# Altium project TDR.PrjPcb
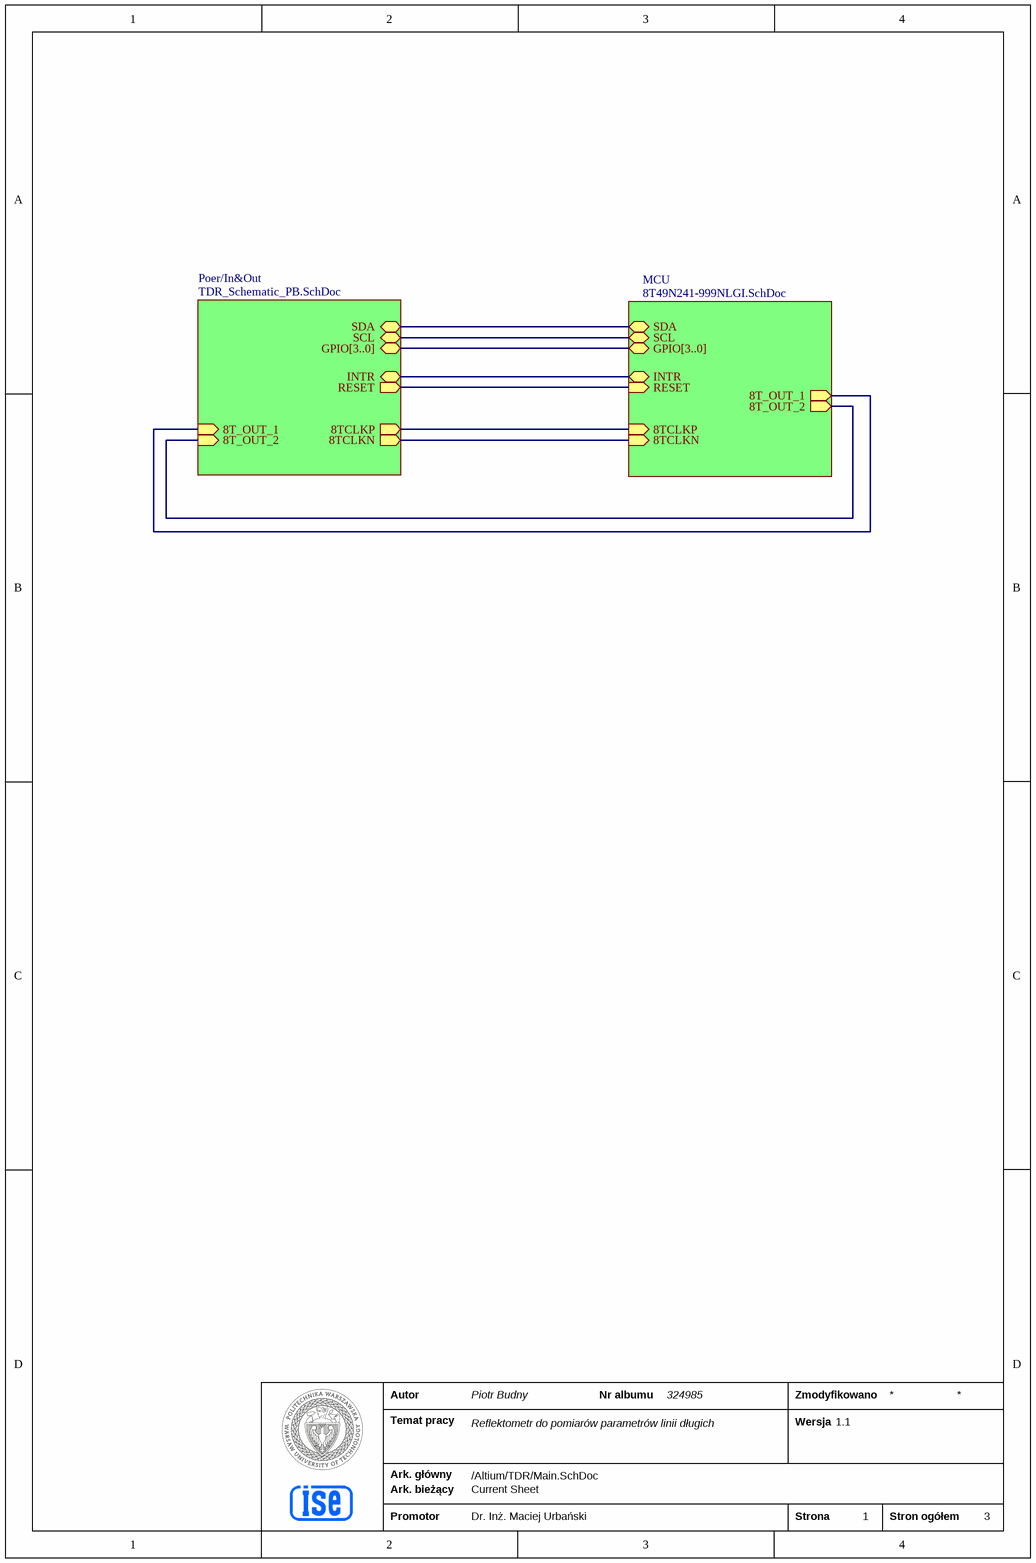
[diagram p0: Main.SchDoc]
3 sheets, 87 parts. Net scope: hierarchical (ports join the sheet entries above them; power ports are global).
Board file: TDR3.PcbDoc
Sheets:
  Main.SchDoc
    Poer/In&Out = TDR_Schematic_PB.SchDoc
    MCU = 8T49N241-999NLGI.SchDoc

## Sheet Main.SchDoc
size A4 portrait; SheetNumber: 1; SheetTotal: 3

### Sub-sheets
MCU = 8T49N241-999NLGI.SchDoc: SDA (bidir), SCL (bidir), GPIO[3..0] (bidir), RESET (in), 8TCLKP (in), 8TCLKN (in), 8T_OUT_1 (out), 8T_OUT_2 (out), INTR (bidir)
Poer/In&Out = TDR_Schematic_PB.SchDoc: SDA (bidir), SCL (bidir), GPIO[3..0] (bidir), INTR (bidir), RESET (out), 8T_OUT_1 (in), 8T_OUT_2 (in), 8TCLKP (out), 8TCLKN (out)

### Nets
8T_CLK_N: sheet Poer/In&Out/8TCLKN, sheet MCU/8TCLKN
8T_CLK_P: sheet Poer/In&Out/8TCLKP, sheet MCU/8TCLKP
8T_OUT_1: sheet Poer/In&Out/8T_OUT_2, sheet MCU/8T_OUT_2
8T_OUT_2: sheet Poer/In&Out/8T_OUT_1, sheet MCU/8T_OUT_1
INTR: sheet Poer/In&Out/INTR, sheet MCU/INTR
RESET: sheet Poer/In&Out/RESET, sheet MCU/RESET
SCL: sheet Poer/In&Out/SCL, sheet MCU/SCL
SDA: sheet Poer/In&Out/SDA, sheet MCU/SDA

### Buses and harness runs
bus sheet MCU/GPIO[3..0] = sheet Poer/In&Out/GPIO[3..0]

### Notes on the sheet
- Autor
- Temat pracy
- Piotr Budny
- Reflektometr do pomiarów parametrów linii długich
- Nr albumu
- 324985
- Zmodyfikowano
- Wersja
- 1.1
- Ark. główny
- Ark. bieżący
- /Altium/TDR/Main.SchDoc
- Current Sheet
- Promotor
- Dr. Inż. Maciej Urbański
- Strona
- Stron ogółem

## Sheet TDR_Schematic_PB.SchDoc: Bardzo zaawansowany, madrze brzmiacy temat pracy dyplomowej. Jest tez bardzo dlugi.
size A4 portrait; Author: Student X.; Revision: 1.1; SheetNumber: 2; SheetTotal: 3; Comments: param:Comments; Wersja: 1.0; CustomerInfo: CustInfo; CustomerAddress: CustAddr; CopyrightBy: Maciejo; CopyrightDate: 2016; TopSheet: Nazwa lub sciezka do pliku z glownym schematem projektu; CurrentSheet: Current sheet; NrIndeksu: 123456; Promotor: Prof. dr. hab. inż. arch. lek. artysta i tynkarz; ProjectName: Project Name
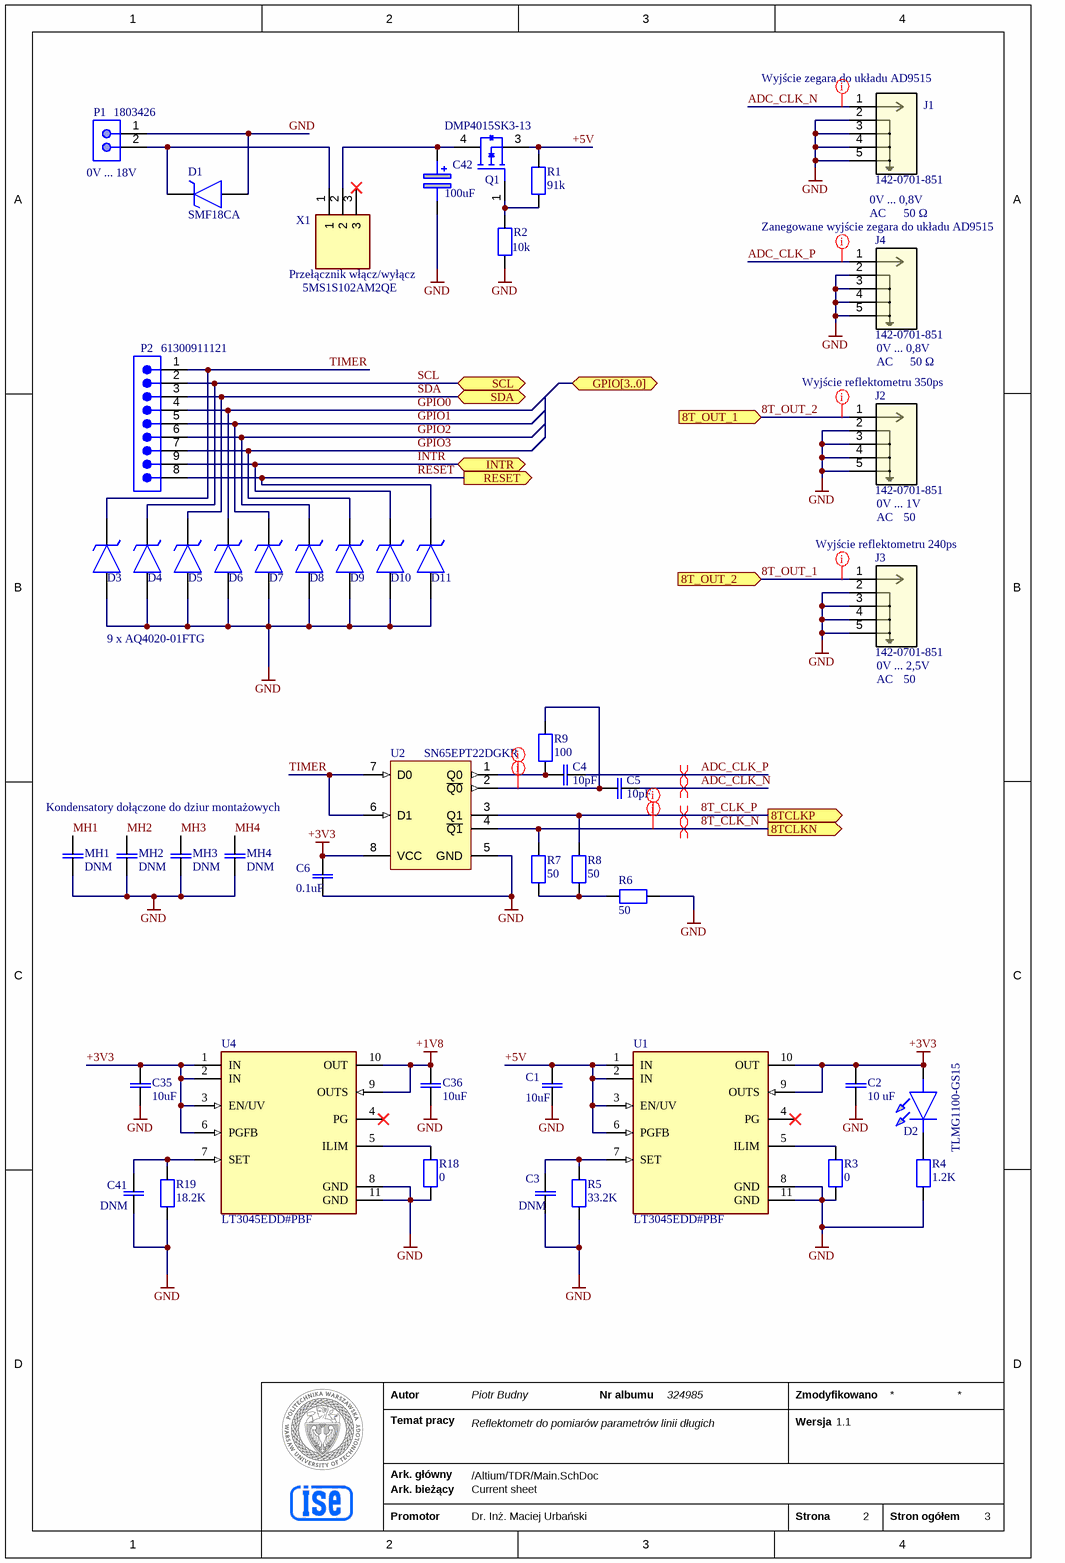
[diagram p1: TDR_Schematic_PB.SchDoc]

### Parts
C1  10uF  [CAP_C0805X-HAC-DR_KEM]
C2  10 uF  [CAP_C0805X-HAC-DR_KEM]
C3  DNM  [CAP_C0805X-HAC-DR_KEM]
C4  10pF  [CAPC0402]
C5  10pF  [CAPC0402]
C6  0.1uF  [CAPC0603]
C35  10uF  [CAP_C0805X-HAC-DR_KEM]
C36  10uF  [CAP_C0805X-HAC-DR_KEM]
C41  DNM  [CAP_C0805X-HAC-DR_KEM]
C42  100uF  [CAPPRD200W55D500H1250 - duplicate]
D1  SMF18CA  [SODFL3618X110N]
D2  TLMG1100-GS15  [TLMG1100GS15]
D3  AQ4020-01FTG  [SOD2613X114N]  (value not drawn)
D4  AQ4020-01FTG  [SOD2613X114N]  (value not drawn)
D5  AQ4020-01FTG  [SOD2613X114N]  (value not drawn)
D6  AQ4020-01FTG  [SOD2613X114N]  (value not drawn)
D7  AQ4020-01FTG  [SOD2613X114N]  (value not drawn)
D8  AQ4020-01FTG  [SOD2613X114N]  (value not drawn)
D9  AQ4020-01FTG  [SOD2613X114N]  (value not drawn)
D10  AQ4020-01FTG  [SOD2613X114N]  (value not drawn)
D11  AQ4020-01FTG  [SOD2613X114N]  (value not drawn)
J1  142-0701-851  [CONN_142-0701-851_CIN]
J2  142-0701-851  [CONN_142-0701-851_CIN]
J3  142-0701-851  [CONN_142-0701-851_CIN]
J4  142-0701-851  [CONN_142-0701-851_CIN]
MH1  DNM  [CAPC0603]
MH2  DNM  [CAPC0603]
MH3  DNM  [CAPC0603]
MH4  DNM  [CAPC0603]
P1  1803426  [PHOE-1803426_V]
P2  61300911121  [61300911121]
Q1  DMP4015SK3-13  [DMP4015SK3-13]
R1  91k  [RES0805]
R2  10k  [RES0805]
R3  0  [RES0805]
R4  1.2K  [RESC0603]
R5  33.2K  [RES0805]
R6  50  [RESC0603]
R7  50  [RESC0603]
R8  50  [RESC0603]
R9  100  [RESC0603]
R18  0  [RES0805]
R19  18.2K  [RES0805]
U1  LT3045EDD#PBF  [FP-LT3045EDD#PBF-MFG]
U2  SN65EPT22DGKR  [DGK0008A_M]
U4  LT3045EDD#PBF  [FP-LT3045EDD#PBF-MFG]
X1  5MS1S102AM2QE  [5MS1S102AM2QE]  (value not drawn)

### Ports
8T_OUT_1 (in, see Main[1B], 8T49N241-999NLGI[4B]), 8T_OUT_2 (in, see Main[1B], 8T49N241-999NLGI[4C]), 8TCLKN (out, see Main[2B], 8T49N241-999NLGI[2B]), 8TCLKP (out, see Main[2B], 8T49N241-999NLGI[2B]), GPIO[3..0] (bidir, see Main[2A], 8T49N241-999NLGI[1C]), INTR (bidir, see Main[2A], 8T49N241-999NLGI[1C]), RESET (out, see Main[2A], 8T49N241-999NLGI[1C]), SCL (bidir, see Main[2A], 8T49N241-999NLGI[1B]), SDA (bidir, see Main[2A], 8T49N241-999NLGI[1B])

### Nets
+1V8: C36.2 U4.9(OUTS) U4.10(OUT)  [project net VCO3]
+3V3: C2.2 C6.2 C35.2 D2.2(A) U1.9(OUTS) U1.10(OUT) U2.8(VCC) U4.1(IN) U4.2(IN) U4.3(EN/UV) U4.6(PGFB)
GND: C1.1 C2.1 C3.1 C6.1 C35.1 C36.1 C41.1 C42.2(-) D1.2(A) D3.2(A) D4.2(A) D5.2(A) D6.2(A) D7.2(A) D8.2(A) D9.2(A) D10.2(A) D11.2(A) J1.2 J1.3 J1.4 J1.5 J2.2 J2.3 J2.4 J2.5 J3.2 J3.3 J3.4 J3.5 J4.2 J4.3 J4.4 J4.5 MH1.1 MH2.1 MH3.1 MH4.1 P1.1 R2.1 R3.1 R4.1 R5.1 R6.1 R18.1 R19.1 U1.8(GND) U1.11(GND) U2.5(GND) U4.8(GND) U4.11(GND)
8T_CLK_N: R7.2 U2.4(~{Q1}) ; port 8TCLKN
8T_CLK_P: R8.2 U2.3(Q1) ; port 8TCLKP
8T_OUT_1: J3.1 ; port 8T_OUT_2
8T_OUT_2: J2.1 ; port 8T_OUT_1
+5V: C1.2 Q1.3 R1.2 U1.1(IN) U1.2(IN) U1.3(EN/UV) U1.6(PGFB)
ADC_CLK_N: C5.2 J1.1
ADC_CLK_P: C4.2 J4.1
GPIO0: D6.1(K) P2.4
GPIO1: D7.1(K) P2.5
GPIO2: D8.1(K) P2.6
GPIO3: D9.1(K) P2.7
INTR: D10.1(K) P2.9 ; port INTR
MH1: MH1.2
MH2: MH2.2
MH3: MH3.2
MH4: MH4.2
RESET: D11.1(K) P2.8 ; port RESET
SCL: D4.1(K) P2.2 ; port SCL
SDA: D5.1(K) P2.3 ; port SDA
TIMER: D3.1(K) P2.1 U2.6(D1) U2.7(D0)
NetC3_2: C3.2 R5.2 U1.7(SET)
NetC4_1: C4.1 R9.1 U2.1(Q0)
NetC5_1: C5.1 R9.2 U2.2(~{Q0})
NetC41_2: C41.2 R19.2 U4.7(SET)
NetC42_1: C42.1(+) Q1.4 X1.2
NetD1_1: D1.1(K) P1.2 X1.1
NetD2_1: D2.1(K) R4.2
NetQ1_1: Q1.1 R1.1 R2.2
NetR3_2: R3.2 U1.5(ILIM)
NetR6_2: R6.2 R7.1 R8.1
NetR18_2: R18.2 U4.5(ILIM)

Not connected (* = marked no-connect by the designer): U1 4(PG)*; U4 4(PG)*; X1 3*

### Layout directives
differential pair: 8T_CLK_N, 8T_CLK_P, ADC_CLK_N, ADC_CLK_P
net class Signal: 8T_OUT_1, 8T_OUT_2
net class Diff_Signal: 8T_CLK_N, 8T_CLK_P, ADC_CLK_N, ADC_CLK_P, NetC4_1, NetC5_1

### Notes on the sheet
- (near J1) Wyjście zegara do układu AD9515
- (near P1) 0V ... 18V
- (near J4) Zanegowane wyjście zegara do układu AD9515
- 0V ... 0,8V
- AC
- 50 Ω
- Przełącznik włącz/wyłącz
- 5MS1S102AM2QE
- (near J4) 0V ... 0,8V
- (near J2) Wyjście reflektometru 350ps
- (near J2) 0V ... 1V
- (near J3) Wyjście reflektometru 240ps
- 50
- 9 x AQ4020-01FTG
- (near J3) 0V ... 2,5V
- (near J3) AC
- (near J3) 50
- Kondensatory dołączone do dziur montażowych
- Autor
- Temat pracy
- Piotr Budny
- Reflektometr do pomiarów parametrów linii długich
- Nr albumu
- 324985
- Zmodyfikowano
- Wersja
- Ark. główny
- Ark. bieżący
- /Altium/TDR/Main.SchDoc
- Promotor
- Dr. Inż. Maciej Urbański
- Strona
- Stron ogółem

### Library data of the parts
C1-C3 C35 C36 C41 = C0805X399C8HAC7800: No Description Available; Manufacturer_Name: Kemet; Copyright: Copyright (C) 2025 Ultra Librarian. All rights reserved.; Manufacturer_Part_Number: C0805X399C8HAC7800
C4 C5 = C0603: No Description Available; Manufacturer_Name: Kemet; Manufacturer_Part_Number: C0805X399C8HAC7800; Copyright: Copyright (C) 2025 Ultra Librarian. All rights reserved.
C6 MH1-MH4 = C0603: CAP SMD 0805; Manufacturer_Name: Kemet; Manufacturer_Part_Number: C0805X399C8HAC7800; Copyright: Copyright (C) 2025 Ultra Librarian. All rights reserved.
C42 = 100uF electrolitic
D1 = SMF5.0A-T13: TVS Diode (Uni-directional); Manufacturer_Name: LITTELFUSE; Datasheet Link: https://www.littelfuse.com/~/media/electronics/datasheets/tvs_diodes/littelfuse_tvs_diode_smf_datasheet.pdf.pdf; Height: 1.1mm; Manufacturer_Part_Number: SMF5.0A-T13; Mouser Part Number: 576-SMF5.0A-T13; Mouser Price/Stock: https://www.mouser.co.uk/ProductDetail/Littelfuse/SMF5.0A-T13?qs=aGgfWYEhH7lEohru0mAWAg%3D%3D; Arrow Part Number: SMF5.0A-T13; Arrow Price/Stock: https://www.arrow.com/en/products/smf5.0a-t13/littelfuse?utm_currency=USD&region=nac
D2 = TLMG1100-GS15: Standard LEDs - SMD CHIPLED(SMD 0603-LED) GREEN U.BRIGHT-E4; Manufacturer_Name: Vishay; Geometry.Height: 0.65mm; Mouser Part Number: 78-TLMG1100-GS15; Mouser Price/Stock: https://www.mouser.co.uk/ProductDetail/Vishay-Semiconductors/TLMG1100-GS15?qs=vvQtp7zwQdObPNLeC1kn7g%3D%3D; Manufacturer_Part_Number: TLMG1100-GS15; Datasheet Link: https://www.vishay.com/docs/83173/tlmx1100.pdf
D3-D11 = AQ4020-01FTG: TVS Diode (Uni-directional); Manufacturer_Name: LITTELFUSE; Datasheet Link: https://componentsearchengine.com/Datasheets/2/AQ4020-01FTG.pdf; Height: 1.14mm; Manufacturer_Part_Number: AQ4020-01FTG; Mouser Part Number: 576-AQ4020-01FTG; Mouser Price/Stock: https://www.mouser.co.uk/ProductDetail/Littelfuse/AQ4020-01FTG?qs=YCa%2FAAYMW015W3B84qpvIw%3D%3D; Arrow Part Number: AQ4020-01FTG; Arrow Price/Stock: https://www.arrow.com/en/products/aq4020-01ftg/littelfuse?utm_currency=USD&region=nac
J1-J4 = 142-0701-851: Description; Manufacturer_Name: Cinch Connectivity Solutions; Copyright: Copyright (C) 2025 Ultra Librarian. All rights reserved.; Manufacturer_Part_Number: 142-0701-851; RefDes: RefDes; Type: Type
P1 = CMP-2000-05826-1: Male Header, Pitch 3.81 mm, 1 x 2 Position, Height 9.2 mm, Tail Length 3.4 mm; Manufacturer: Phoenix Contact; Manufacturer URL: http://www.phoenixcontact.com/; Datasheet Version: 02/2015; Mounting Technology: ThroughHole; Package Description: Male Header, Pitch 3.81 mm, 1 x 2 Position, Height 9.2 mm; Datasheet URL: https://www.phoenixcontact.com/online/portal/cn/pxc/product_detail_page/!ut/p/b1/3VfHjrNIGHyWeQDG5HAkm5zjxQIM2AQDNvnp1zNa7WFX889l5YPpA6L1qUtVdFX3d4gPEYCiFAaBJHgID_Etma9lMl67W9J8fcf4iRJ1HIRRHAIZDANpTKVtR3IFAyUOwSEE0ZNTbb2iOquuOqg8OKsEReRD0XpT8cAJtHK1h62gd5Lwwj7fSR7gfNZiWNE2tu2Xg71pvaHw3VHbDIccysUbixteZxggMWJnxWgP9KIolKko13HrKNI0OD69xjcsLwZb9oJmcNi4flh1xw9LW6-eWTQ9nREGMg82nQ7i5d6Jdk07dw7fZbrokLagaoyYggEvB4C7H5W4HERjSAam7I1pSvC1iqzSu8itk8CidtE6n3bP2nD0Pp6iRD-LQiLob5pFzwLixwIWO7iH0PcgleukhedgldkYbrFLA5WSM7ufG5_qGPkUc9vEzZQaS901mlWkPYn5tWxhabkCUfW4SsSIbpPuMIJHpQReslhERyEnqVrZBIU1V5Nilrs5X123FVtC3BVOSLHMP1b6PfXsNSgk1T-F50SEmtzqQUXqhsW5rwQ1o0BXB2gELrcQ4gCUoNAFTBX6N2LEmxJz0Hclhr8rsXf1mPOuHoPf1WPwu3oMflePSW-7Fd81PGj4i1jqc2r6kGnO3K4b7QxsE14hAduG8C7FaT2GvZ7I-s0j05SGAI1kaO9y99Mt55acg9cLDNYaWwQcdDTPAtjrfMY1OBkOcVEr9HZ8tGspIQLbIVDtpjctgzHFMG4BAZsGvQthBBH4WA-nFo17BJ08nhvnnSIvtClxxDZLZLDt43EXgXAD-FUl6xp1LReX8w3Sb-3dEFiLergsTPmiPWlKHKTnUE9MvjMWis8MoKAxhXcLRQoyR1OjaJFnuS2q9AQSlWi71_PQS1I7hwNcTAR9vGjIY_k4yIf4mrafS9Z-gp_9mn329-4; Package Reference: 1803426
P2 = CMP-1502-01080-4: THT Vertical Pin Header WR-PHD, Pitch 2.54 mm, Single Row, 9 pins; Current Rating: 3A; Connector Type: Male Pin; Operating Supply Voltage: 250V; Contact Resistance: 20mΩ; Pitch: 2.54mm; Number of Contacts: 9; Gender: Male; Lead Pitch: 2.54mm; Number of Rows: 1; Mount: Through Hole; Contact Plating: Gold; Color: Black; Number of Pins: 9; Orientation: Vertical; Contact Material: Copper; Packaging: Bulk; Contact Mating Length: 5.9944mm; RoHS: Compliant; Number of Positions: 9; Termination: Solder
R1-R3 R5 R18 R19 = R0805: RES SMD 0805; MP: RT0805FRE075K36L; Package: None; Price: None; Value: *; Availability: Unavailable
R4 R6-R9 = R0603: RES SMD 0603; MP: RT0805FRE075K36L; Package: None; Price: None; Value: *; Availability: Unavailable
U1 U4 = CMP-09138-000240-1: IC REG LINEAR 0V 500MA 10DFN; Min Current Limit: 570mA; Number of Regulators: 1; Dropout Voltage: 260mV; Output Voltage: 15V; RoHS Compliant: Yes; Series: -; Output Current: 500mA; Case/Package: DFN; Max Operating Temperature: 125°C; Min Operating Temperature: -40°C
U2 = CMP-0327-00215-3: 4000 Mbps 3.3 V Dual LVTTL / LVCMOS to Differential LVPECL Buffer, 2 Tx and 2 Rx, -40 to +85 degC, 8-pin VSSOP (DGK), Green (RoHS & no Sb/Br); Manufacturer: Texas Instruments; ICC(Max)(mA): 50; Input Signal: LVTTL, CMOS; No. of Rx: 2; SubFamily: PECL PHY; Signaling Rate(Mbps): 4000; xECL: TRUE; DatasheetVersion: SLLS926A; Output Signal: LVPECL; ComponentLink3Description: URL Link1; PackageVersion: revE, May-2006; ComponentLink1Description: Manufacturer URL; ComponentLink2Description: Datasheet; No. of Tx: 2; ComponentLink1URL: http://www.ti.com/; PackageReference: DGK0008A; Eco-Plan: Green (RoHS & no Sb/Br); Mounting Technology: Surface Mount; PackageDescription: 8-Pin Thin Small Outline Package 3 x 3 mm Body ,0.65 mm Pitch; ComponentLink2URL: http://www.ti.com/general/docs/lit/getliterature.tsp?genericPartNumber=SN65EPT22&fileType=pdf; ComponentLink3URL: SamplesURL:http://www.ti.com/product/sn65ept22#samples; PartNumber: SN65EPT22DGKR
X1 = 5MS1S102AM2QE: Switch: Slide; Positions: 2; SPDT; 2A/250VAC; 5A/28VDC; ON-ON; Manufacturer_Name: LIGHT COUNTRY; Geometry.Height: 12.93mm; TME Electronic Components Part Number: *; TME Electronic Components Price/Stock: *; Manufacturer_Part_Number: 5MS1S102AM2QE; Datasheet Link: https://www.tme.eu/Document/6c0299ce3235dd46f456febe8a77357f/slide_switch_5M.PDF

## Sheet 8T49N241-999NLGI.SchDoc: Bardzo zaawansowany, madrze brzmiacy temat pracy dyplomowej. Jest tez bardzo dlugi.
size A4 portrait; Author: Student X.; Revision: 1.1; SheetNumber: 3; SheetTotal: 3; Comments: param:Comments; Wersja: 1.1; CustomerInfo: CustInfo; CustomerAddress: CustAddr; CopyrightBy: Maciejo; CopyrightDate: 2016; TopSheet: Nazwa lub sciezka do pliku z glownym schematem projektu; CurrentSheet: Current sheet; NrIndeksu: 123456; Promotor: Prof. dr. hab. inż. arch. lek. artysta i tynkarz; ProjectName: Project Name
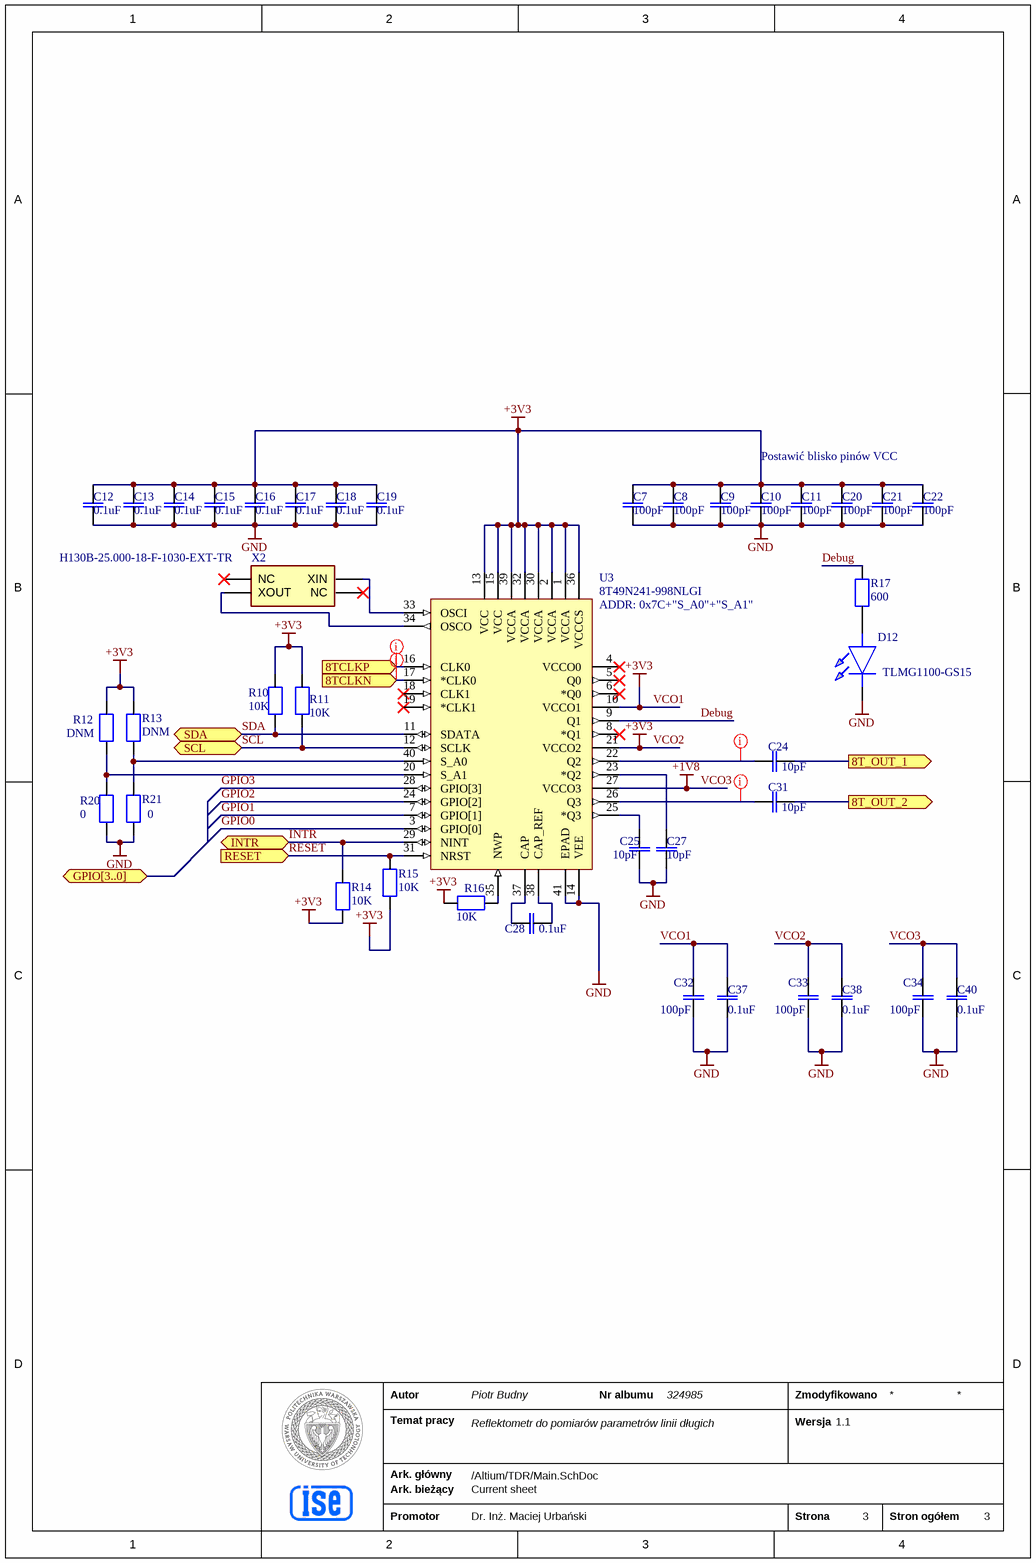
[diagram p2: 8T49N241-999NLGI.SchDoc]

### Parts
C7  100pF  [CAPC0603]
C8  100pF  [CAPC0603]
C9  100pF  [CAPC0603]
C10  100pF  [CAPC0603]
C11  100pF  [CAPC0603]
C12  0.1uF  [CAPC0603]
C13  0.1uF  [CAPC0603]
C14  0.1uF  [CAPC0603]
C15  0.1uF  [CAPC0603]
C16  0.1uF  [CAPC0603]
C17  0.1uF  [CAPC0603]
C18  0.1uF  [CAPC0603]
C19  0.1uF  [CAPC0603]
C20  100pF  [CAPC0603]
C21  100pF  [CAPC0603]
C22  100pF  [CAPC0603]
C24  10pF  [CAPC0402]
C25  10pF  [CAPC0402]
C27  10pF  [CAPC0402]
C28  0.1uF  [CAPC0603]
C31  10pF  [CAPC0402]
C32  100pF  [CAPC0603]
C33  100pF  [CAPC0603]
C34  100pF  [CAPC0603]
C37  0.1uF  [CAPC0603]
C38  0.1uF  [CAPC0603]
C40  0.1uF  [CAPC0603]
D12  TLMG1100-GS15  [TLMG1100GS15]
R10  10K  [RES0805]
R11  10K  [RES0805]
R12  DNM  [RES0805]
R13  DNM  [RES0805]
R14  10K  [RES0805]
R15  10K  [RES0805]
R16  10K  [RES0805]
R17  600  [RES0805]
R20  0  [RES0805]
R21  0  [RES0805]
U3  8T49N241-998NLGI  [NLG40P2_MFG]
X2  H130B-25.000-18-F-1030-EXT-TR  [H130B2500018F1030EXTTR]

### Ports
8T_OUT_1 (out, see Main[4B], TDR_Schematic_PB[3B]), 8T_OUT_2 (out, see Main[4B], TDR_Schematic_PB[3B]), 8TCLKN (in, see Main[3B], TDR_Schematic_PB[3C]), 8TCLKP (in, see Main[3B], TDR_Schematic_PB[3C]), GPIO[3..0] (bidir, see Main[3A], TDR_Schematic_PB[3A]), INTR (bidir, see Main[3A], TDR_Schematic_PB[2B]), RESET (in, see Main[3A], TDR_Schematic_PB[2B]), SCL (bidir, see Main[3A], TDR_Schematic_PB[2A]), SDA (bidir, see Main[3A], TDR_Schematic_PB[2B])

### Nets
+3V3: C7.1 C8.1 C9.1 C10.1 C11.1 C12.2 C13.2 C14.2 C15.2 C16.2 C17.2 C18.2 C19.2 C20.1 C21.1 C22.1 C32.1 C33.1 C37.2 C38.2 R10.2 R11.2 R12.2 R13.2 R14.1 R15.1 R16.2 U3.1(VCCA) U3.2(VCCA) U3.10(VCCO1) U3.13(VCC) U3.15(VCC) U3.21(VCCO2) U3.30(VCCA) U3.32(VCCA) U3.36(VCCCS) U3.39(VCCA)  [also labelled VCO1, VCO2]
GND: C7.2 C8.2 C9.2 C10.2 C11.2 C12.1 C13.1 C14.1 C15.1 C16.1 C17.1 C18.1 C19.1 C20.2 C21.2 C22.2 C25.1 C27.1 C32.2 C33.2 C34.2 C37.1 C38.1 C40.1 D12.1(K) R20.1 R21.1 U3.14(VEE) U3.41(EPAD)
VCO3: C34.1 C40.2 U3.27(VCCO3)  [also labelled +1V8]
8T_CLK_N: U3.17(*CLK0) ; port 8TCLKN
8T_CLK_P: U3.16(CLK0) ; port 8TCLKP
8T_OUT_1: C31.2 ; port 8T_OUT_2
8T_OUT_2: C24.2 ; port 8T_OUT_1
Debug: R17.1 U3.9(Q1)
GPIO0: U3.3(GPIO[0])
GPIO1: U3.7(GPIO[1])
GPIO2: U3.24(GPIO[2])
GPIO3: U3.28(GPIO[3])
INTR: R14.2 U3.29(NINT) ; port INTR
RESET: R15.2 U3.31(NRST) ; port RESET
SCL: R11.1 U3.12(SCLK) ; port SCL
SDA: R10.1 U3.11(SDATA) ; port SDA
NetC24_1: C24.1 U3.22(Q2)
NetC25_2: C25.2 U3.25(*Q3)
NetC27_2: C27.2 U3.23(*Q2)
NetC28_1: C28.1 U3.38(CAP_REF)
NetC28_2: C28.2 U3.37(CAP)
NetC31_1: C31.1 U3.26(Q3)
NetD12_2: D12.2(A) R17.2
NetR12_1: R12.1 R20.2 U3.20(S_A1)
NetR13_1: R13.1 R21.2 U3.40(S_A0)
NetR16_1: R16.1 U3.35(NWP)
NetU3_33: U3.33(OSCI) X2.1(XIN)
NetU3_34: U3.34(OSCO) X2.3(XOUT)

Not connected (* = marked no-connect by the designer): U3 4(VCCO0)* 5(Q0)* 6(*Q0)* 8(*Q1)* 18(CLK1)* 19(*CLK1)*; X2 2(NC)* 4(NC)*

### Layout directives
net class Signal: NetC24_1, NetC31_1
net class Diff_Signal: 8T_CLK_N, 8T_CLK_P

### Notes on the sheet
- Postawić blisko pinów VCC
- (near U3) ADDR: 0x7C+"S_A0"+"S_A1"
- Autor
- Temat pracy
- Piotr Budny
- Reflektometr do pomiarów parametrów linii długich
- Nr albumu
- 324985
- Zmodyfikowano
- Wersja
- Ark. główny
- Ark. bieżący
- /Altium/TDR/Main.SchDoc
- Promotor
- Dr. Inż. Maciej Urbański
- Strona
- Stron ogółem

### Library data of the parts
C7-C11 C20-C22 C24 C25 C27 C31-C34 = C0603: as C4 on sheet TDR_Schematic_PB; Copyright: Copyright (C) 2025 Ultra Librarian. All rights reserved.
C12-C19 C37 C38 C40 = C0603: as C6 on sheet TDR_Schematic_PB; Copyright: Copyright (C) 2025 Ultra Librarian. All rights reserved.
C28 = C0603: CAP SMD 0603; Manufacturer_Name: Kemet; Manufacturer_Part_Number: C0805X399C8HAC7800; Copyright: Copyright (C) 2025 Ultra Librarian. All rights reserved.
D12 = TLMG1100-GS15: as D2 on sheet TDR_Schematic_PB; Mouser Part Number: 78-TLMG1100-GS15; Mouser Price/Stock: https://www.mouser.co.uk/ProductDetail/Vishay-Semiconductors/TLMG1100-GS15?qs=vvQtp7zwQdObPNLeC1kn7g%3D%3D; Manufacturer_Part_Number: TLMG1100-GS15; Datasheet Link: https://www.vishay.com/docs/83173/tlmx1100.pdf
R10-R17 R20 R21 = R0805: RES SMD 0805; MP: RT0805FRE075K36L; Package: None; Price: None; Value: *; Availability: Unavailable
U3 = 8T49N241-999NLGI: Tin Active e3 CLOCK GENERATOR OTHER (Type) IC 18Weeks -40C 6mm 1GHz; Number of Circuits: 1; Input: Crystal; Interface: I2C; Phase Jitter: 350fs; Max Input Voltage: 3.465V; Pitch: 500µm; Output Type: HCSL, LVCMOS, LVDS, LVPECL; Min Input Voltage: 1.71V; ComponentLink2URL: https://octopart.com/cad-content/api/get-model-datasheet/15189/106937583; RoHS: Compliant; Lead Free: Lead Free; Max Operating Temperature: 85°C; Lifecycle Status: Production; ComponentLink1URL: http://www.renesas.com; Max Frequency: 1GHz; Contact Plating: Tin; Export Control Classification Number (ECCN) Code: NLR; ComponentLink2Description: Datasheet URL; HelpURL: https://octopart.com/cad-content/api/get-model-datasheet/15189/106937583; Length: 6mm; MSL: 3; Part Family: 8T49N241; Height: 900µm; Max Output Frequency: 1GHz; ComponentLink1Description: Manufacturer's Website; ComponentLink3URL: https://www.renesas.com/en/document/psc/package-outline-drawing-package-code-nlg40p2-40-vfqfp-n-60-x-60-x-090-mm-body-05mm-pitch; Width: 6mm; ComponentLink3Description: Manufacturer's Package Drawing; Number of Pins: 40; Manufacturer Lifecycle Status: ACTIVE; Min Operating Temperature: -40°C; Harmonized Tariff Schedule (HTS) Code: 8540000000; Thickness: 900µm; Mount: Surface Mount; Package Quantity: 0
X2 = H130B-25.000-18-F-1030-EXT-TR: MHz Crystal, 25 MHz, 5 x 3.2 mm, +/-10 ppm tolerance, +/-30 ppm stability, 18 pF, -40~85C, SMD; Manufacturer_Name: RALTRON; Geometry.Height: 0.9mm; Farnell Part Number: *; Farnell Price/Stock: *; Manufacturer_Part_Number: H130B-25.000-18-F-1030-EXT-TR; Datasheet Link: https://raltron.com/webproducts/specs/CRYSTAL/H130B-25.000-18-F-1030-EXT-TR.pdf

## Nets that join several sheets
+3V3: TDR_Schematic_PB (11 pins), 8T49N241-999NLGI (37 pins)
GND: TDR_Schematic_PB (51 pins), 8T49N241-999NLGI (29 pins)
VCO3: TDR_Schematic_PB (C36.2 U4.9 U4.10), 8T49N241-999NLGI (C34.1 C40.2 U3.27)
8T_CLK_N: TDR_Schematic_PB (R7.2 U2.4), 8T49N241-999NLGI (U3.17)
8T_CLK_P: TDR_Schematic_PB (R8.2 U2.3), 8T49N241-999NLGI (U3.16)
8T_OUT_1: TDR_Schematic_PB (J3.1), 8T49N241-999NLGI (C31.2)
8T_OUT_2: TDR_Schematic_PB (J2.1), 8T49N241-999NLGI (C24.2)
INTR: TDR_Schematic_PB (D10.1 P2.9), 8T49N241-999NLGI (R14.2 U3.29)
RESET: TDR_Schematic_PB (D11.1 P2.8), 8T49N241-999NLGI (R15.2 U3.31)
SCL: TDR_Schematic_PB (D4.1 P2.2), 8T49N241-999NLGI (R11.1 U3.12)
SDA: TDR_Schematic_PB (D5.1 P2.3), 8T49N241-999NLGI (R10.1 U3.11)